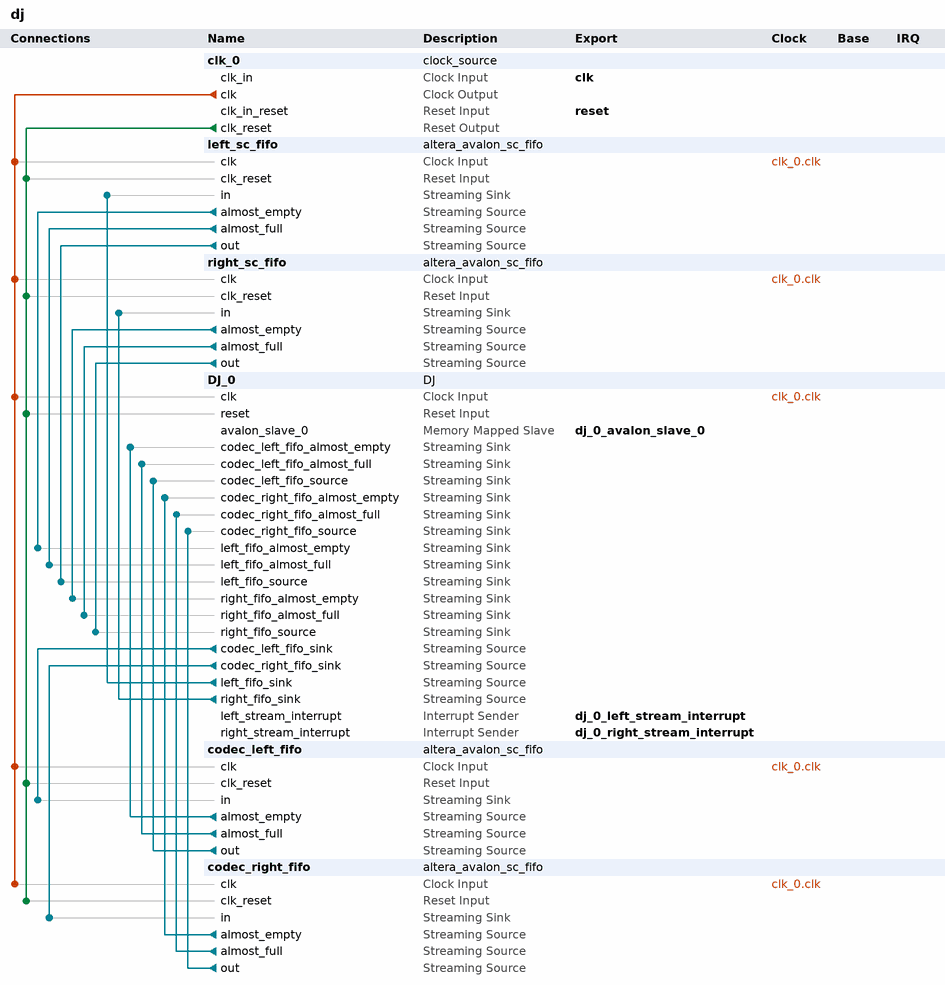
[diagram p0: system contents]
# Platform Designer (Qsys) system dj, Cyclone V 5CEBA2F17A7
# Parameters at their usual value, and those the tool derives, are not listed.
package require -exact qsys 23.1
create_system dj
set_project_property DEVICE_FAMILY {Cyclone V}
set_project_property DEVICE 5CEBA2F17A7

add_instance clk_0 clock_source 23.1
set_instance_parameter_value clk_0 clockFrequency 50000000

add_instance left_sc_fifo altera_avalon_sc_fifo 23.1
set_instance_parameter_value left_sc_fifo BITS_PER_SYMBOL 8
set_instance_parameter_value left_sc_fifo CHANNEL_WIDTH 0
set_instance_parameter_value left_sc_fifo ERROR_WIDTH 0
set_instance_parameter_value left_sc_fifo FIFO_DEPTH 1024
set_instance_parameter_value left_sc_fifo SYMBOLS_PER_BEAT 2
set_instance_parameter_value left_sc_fifo USE_ALMOST_EMPTY_IF 1
set_instance_parameter_value left_sc_fifo USE_ALMOST_FULL_IF 1
set_instance_parameter_value left_sc_fifo USE_FILL_LEVEL 1
set_instance_parameter_value left_sc_fifo USE_MEMORY_BLOCKS 1
set_instance_parameter_value left_sc_fifo USE_STORE_FORWARD 0

add_instance right_sc_fifo altera_avalon_sc_fifo 23.1
set_instance_parameter_value right_sc_fifo BITS_PER_SYMBOL 8
set_instance_parameter_value right_sc_fifo CHANNEL_WIDTH 0
set_instance_parameter_value right_sc_fifo ERROR_WIDTH 0
set_instance_parameter_value right_sc_fifo FIFO_DEPTH 1024
set_instance_parameter_value right_sc_fifo SYMBOLS_PER_BEAT 2
set_instance_parameter_value right_sc_fifo USE_ALMOST_EMPTY_IF 1
set_instance_parameter_value right_sc_fifo USE_ALMOST_FULL_IF 1
set_instance_parameter_value right_sc_fifo USE_FILL_LEVEL 1
set_instance_parameter_value right_sc_fifo USE_MEMORY_BLOCKS 1
set_instance_parameter_value right_sc_fifo USE_STORE_FORWARD 0

add_instance DJ_0 DJ 1.0
set_instance_parameter_value DJ_0 FFT_IWIDTH 16
set_instance_parameter_value DJ_0 FFT_OWIDTH 21
set_instance_parameter_value DJ_0 IFFT_IWIDTH 21
set_instance_parameter_value DJ_0 IFFT_OWIDTH 26
set_instance_parameter_value DJ_0 LGWIDTH 9

add_instance codec_left_fifo altera_avalon_sc_fifo 23.1
set_instance_parameter_value codec_left_fifo BITS_PER_SYMBOL 8
set_instance_parameter_value codec_left_fifo CHANNEL_WIDTH 0
set_instance_parameter_value codec_left_fifo ERROR_WIDTH 0
set_instance_parameter_value codec_left_fifo FIFO_DEPTH 1024
set_instance_parameter_value codec_left_fifo SYMBOLS_PER_BEAT 2
set_instance_parameter_value codec_left_fifo USE_ALMOST_EMPTY_IF 1
set_instance_parameter_value codec_left_fifo USE_ALMOST_FULL_IF 1
set_instance_parameter_value codec_left_fifo USE_FILL_LEVEL 1
set_instance_parameter_value codec_left_fifo USE_MEMORY_BLOCKS 1
set_instance_parameter_value codec_left_fifo USE_STORE_FORWARD 0

add_instance codec_right_fifo altera_avalon_sc_fifo 23.1
set_instance_parameter_value codec_right_fifo BITS_PER_SYMBOL 8
set_instance_parameter_value codec_right_fifo CHANNEL_WIDTH 0
set_instance_parameter_value codec_right_fifo ERROR_WIDTH 0
set_instance_parameter_value codec_right_fifo FIFO_DEPTH 1024
set_instance_parameter_value codec_right_fifo SYMBOLS_PER_BEAT 2
set_instance_parameter_value codec_right_fifo USE_ALMOST_EMPTY_IF 1
set_instance_parameter_value codec_right_fifo USE_ALMOST_FULL_IF 1
set_instance_parameter_value codec_right_fifo USE_FILL_LEVEL 1
set_instance_parameter_value codec_right_fifo USE_MEMORY_BLOCKS 1
set_instance_parameter_value codec_right_fifo USE_STORE_FORWARD 0

# connections
add_connection clk_0.clk codec_left_fifo.clk clock
add_connection clk_0.clk codec_right_fifo.clk clock
add_connection clk_0.clk DJ_0.clk clock
add_connection clk_0.clk left_sc_fifo.clk clock
add_connection clk_0.clk right_sc_fifo.clk clock
add_connection clk_0.clk_reset codec_left_fifo.clk_reset reset
add_connection clk_0.clk_reset codec_right_fifo.clk_reset reset
add_connection clk_0.clk_reset DJ_0.reset reset
add_connection clk_0.clk_reset left_sc_fifo.clk_reset reset
add_connection clk_0.clk_reset right_sc_fifo.clk_reset reset
add_connection codec_left_fifo.almost_empty DJ_0.codec_left_fifo_almost_empty avalon_streaming
add_connection codec_left_fifo.almost_full DJ_0.codec_left_fifo_almost_full avalon_streaming
add_connection codec_left_fifo.out DJ_0.codec_left_fifo_source avalon_streaming
add_connection codec_right_fifo.almost_empty DJ_0.codec_right_fifo_almost_empty avalon_streaming
add_connection codec_right_fifo.almost_full DJ_0.codec_right_fifo_almost_full avalon_streaming
add_connection codec_right_fifo.out DJ_0.codec_right_fifo_source avalon_streaming
add_connection DJ_0.codec_left_fifo_sink codec_left_fifo.in avalon_streaming
add_connection DJ_0.codec_right_fifo_sink codec_right_fifo.in avalon_streaming
add_connection DJ_0.left_fifo_sink left_sc_fifo.in avalon_streaming
add_connection DJ_0.right_fifo_sink right_sc_fifo.in avalon_streaming
add_connection left_sc_fifo.almost_empty DJ_0.left_fifo_almost_empty avalon_streaming
add_connection left_sc_fifo.almost_full DJ_0.left_fifo_almost_full avalon_streaming
add_connection left_sc_fifo.out DJ_0.left_fifo_source avalon_streaming
add_connection right_sc_fifo.almost_empty DJ_0.right_fifo_almost_empty avalon_streaming
add_connection right_sc_fifo.almost_full DJ_0.right_fifo_almost_full avalon_streaming
add_connection right_sc_fifo.out DJ_0.right_fifo_source avalon_streaming

# exported interfaces
add_interface clk clock sink
set_interface_property clk EXPORT_OF clk_0.clk_in
add_interface dj_0_avalon_slave_0 avalon slave
set_interface_property dj_0_avalon_slave_0 EXPORT_OF DJ_0.avalon_slave_0
add_interface dj_0_left_stream_interrupt interrupt sender
set_interface_property dj_0_left_stream_interrupt EXPORT_OF DJ_0.left_stream_interrupt
add_interface dj_0_right_stream_interrupt interrupt sender
set_interface_property dj_0_right_stream_interrupt EXPORT_OF DJ_0.right_stream_interrupt
add_interface reset reset sink
set_interface_property reset EXPORT_OF clk_0.clk_in_reset

set_interconnect_requirement {$system} qsys_mm.clockCrossingAdapter HANDSHAKE
set_interconnect_requirement {$system} qsys_mm.enableEccProtection FALSE
set_interconnect_requirement {$system} qsys_mm.insertDefaultSlave FALSE
set_interconnect_requirement {$system} qsys_mm.maxAdditionalLatency 1

save_system dj.qsys
